# EAGLE design sch1 (EAGLE 7.2.0)
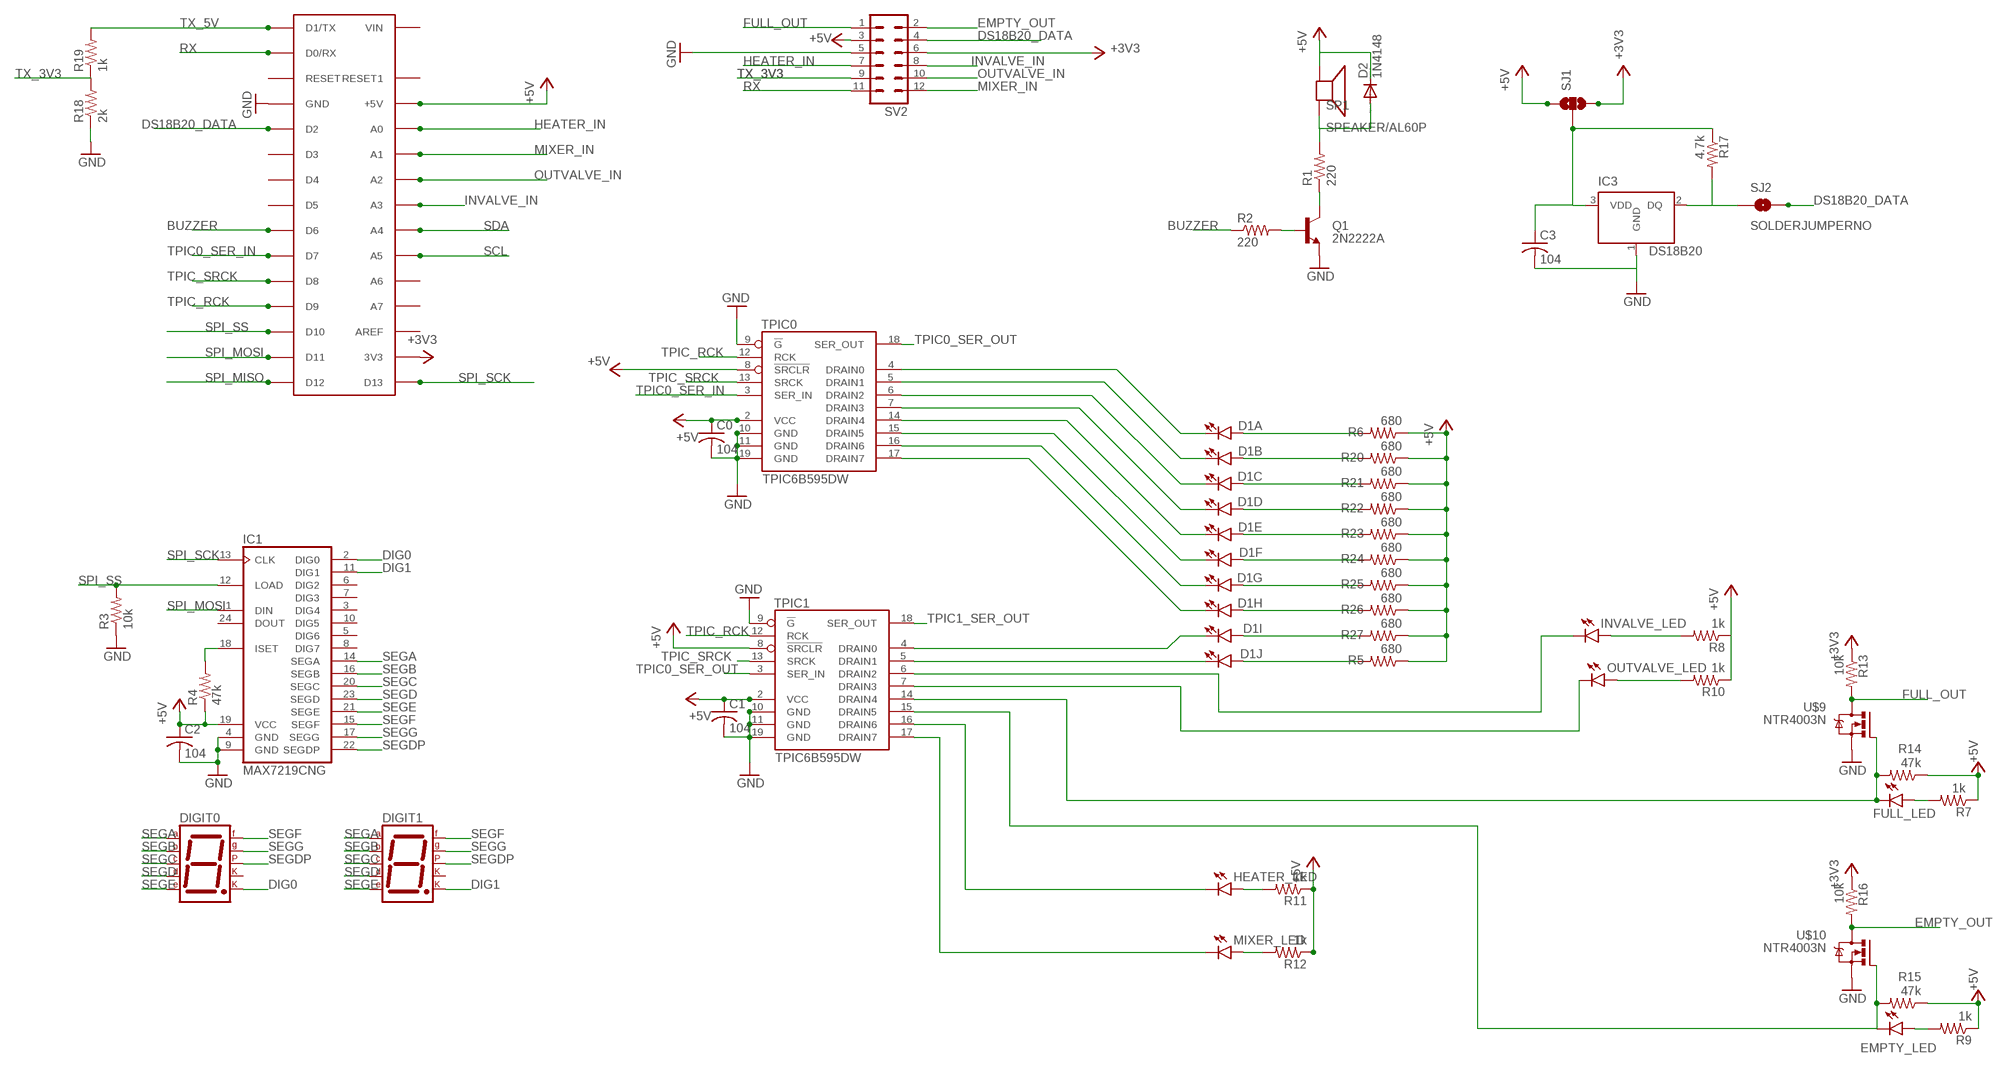
[diagram p0: schematic, sheet 1]

## Parts
ARDUINO  ARDUINONANO  [PDIP-32]
C0  104  C-USC0603  [C0603]
C1  104  C-USC0603  [C0603]
C2  104  C-USC0603  [C0603]
C3  104  C-USC0603  [C0603]
D1  LED_BARGRAPH_10  [LED_BARGAPH_10]
D2  1N4148  1N4148DO35-7  [DO35-7]
DIGIT0  7SEG-CK  [7SEG-13]
DIGIT1  7SEG-CK  [7SEG-13]
EMPTY_LED  LED0603  [LED-0603]
FULL_LED  LED0603  [LED-0603]
HEATER_LED  LED0603  [LED-0603]
IC1  MAX7219CNG  [DIL24-3]
IC3  DS18B20  [TO-92]
INVALVE_LED  LED0603  [LED-0603]
MIXER_LED  LED0603  [LED-0603]
OUTVALVE_LED  LED0603  [LED-0603]
Q1  2N2222A  TRANSISTOR_NPNMMBT2222A  [SOT23-3]
R1  220  R-US_R0603  [R0603]
R2  220  R-US_R0603  [R0603]
R3  10k  R-US_R0603  [R0603]
R4  47k  R-US_R0603  [R0603]
R5  680  R-US_R0603  [R0603]
R6  680  R-US_R0603  [R0603]
R7  1k  R-US_R0603  [R0603]
R8  1k  R-US_R0603  [R0603]
R9  1k  R-US_R0603  [R0603]
R10  1k  R-US_R0603  [R0603]
R11  1k  R-US_R0603  [R0603]
R12  1k  R-US_R0603  [R0603]
R13  10k  R-US_R0603  [R0603]
R14  47k  R-US_R0603  [R0603]
R15  47k  R-US_R0603  [R0603]
R16  10k  R-US_R0603  [R0603]
R17  4.7k  R-US_R0603  [R0603]
R18  2k  R-US_R0603  [R0603]
R19  1k  R-US_R0603  [R0603]
R20  680  R-US_R0603  [R0603]
R21  680  R-US_R0603  [R0603]
R22  680  R-US_R0603  [R0603]
R23  680  R-US_R0603  [R0603]
R24  680  R-US_R0603  [R0603]
R25  680  R-US_R0603  [R0603]
R26  680  R-US_R0603  [R0603]
R27  680  R-US_R0603  [R0603]
SJ1  SOLDERJUMPER_2WAYS  [SJ_3]
SJ2  SOLDERJUMPERNO  [SJ_2S-NO]
SP1  SPEAKER/AL60P  [AL60P]
SV2  MA06-2  [MA06-2]
TPIC0  TPIC6B595DW  [SO20W]
TPIC1  TPIC6B595DW  [SO20W]
U$9  NTR4003N  [SOT23]
U$10  NTR4003N  [SOT23]

## Nets
+3V3: ARDUINO.17(3V3) R13.1 R16.1 SJ1.3 SV2.6
+5V: ARDUINO.27(+5V) C0.1 C1.1 C2.1 D2.C IC1.19(VCC) R4.1 R5.1 R6.1 R7.1 R8.1 R9.1 R10.1 R11.1 R12.1 R14.1 R15.1 R20.1 R21.1 R22.1 R23.1 R24.1 R25.1 R26.1 R27.1 SJ1.1 SP1.1(+) SV2.3 TPIC0.2(VCC) TPIC0.8(!SRCLR) TPIC1.2(VCC) TPIC1.8(!SRCLR)
BUZZER: ARDUINO.9(D6) R2.1
DIG0: DIGIT0.8(CK2) IC1.2(DIG0)
DIG1: DIGIT1.8(CK2) IC1.11(DIG1)
DS18B20_DATA: ARDUINO.5(D2) SJ2.2 SV2.4
EMPTY_OUT: R16.2 SV2.2 U$10.3(D)
FULL_OUT: R13.2 SV2.1 U$9.3(D)
GND: ARDUINO.4(GND) ARDUINO.29(GND) C0.2 C1.2 C2.2 C3.2 IC1.4(GND) IC1.9(GND) IC3.1(GND) Q1.2(E) R3.1 R18.1 SV2.5 TPIC0.9(!G) TPIC0.10(GND) TPIC0.11(GND) TPIC0.19(GND) TPIC1.9(!G) TPIC1.10(GND) TPIC1.11(GND) TPIC1.19(GND) U$9.2(S) U$10.2(S)
HEATER_IN: ARDUINO.19(A0) SV2.7
INVALVE_IN: ARDUINO.22(A3) SV2.8
MIXER_IN: ARDUINO.20(A1) SV2.12
N$1: D1.2(B:A) R20.2
N$2: D1.1(A:A) R6.2
N$3: FULL_LED.A R7.2
N$4: INVALVE_LED.A R8.2
N$5: D1.16(E:C) TPIC0.14(DRAIN4)
N$6: D1.15(F:C) TPIC0.15(DRAIN5)
N$7: D1.3(C:A) R21.2
N$8: D1.13(H:C) TPIC0.17(DRAIN7)
N$9: D1.12(I:C) TPIC1.4(DRAIN0)
N$10: D1.11(J:C) TPIC1.5(DRAIN1)
N$11: EMPTY_LED.C R15.2 TPIC1.15(DRAIN5) U$10.1(G)
N$12: OUTVALVE_LED.C TPIC1.7(DRAIN3)
N$13: HEATER_LED.C TPIC1.16(DRAIN6)
N$14: MIXER_LED.C TPIC1.17(DRAIN7)
N$15: INVALVE_LED.C TPIC1.6(DRAIN2)
N$16: D2.A R1.2 SP1.2(-)
N$17: FULL_LED.C R14.2 TPIC1.14(DRAIN4) U$9.1(G)
N$18: Q1.3(C) R1.1
N$19: Q1.1(B) R2.2
N$20: IC1.18(ISET) R4.2
N$21: D1.14(G:C) TPIC0.16(DRAIN6)
N$22: D1.20(A:C) TPIC0.4(DRAIN0)
N$23: D1.19(B:C) TPIC0.5(DRAIN1)
N$24: D1.18(C:C) TPIC0.6(DRAIN2)
N$25: D1.17(D:C) TPIC0.7(DRAIN3)
N$26: D1.4(D:A) R22.2
N$27: D1.5(E:A) R23.2
N$28: D1.6(F:A) R24.2
N$29: D1.7(G:A) R25.2
N$30: D1.8(H:A) R26.2
N$31: D1.9(I:A) R27.2
N$32: D1.10(J:A) R5.2
N$33: C3.1 IC3.3(VDD) R17.1 SJ1.2
N$34: IC3.2(DQ) R17.2 SJ2.1
N$36: EMPTY_LED.A R9.2
N$37: OUTVALVE_LED.A R10.2
N$38: HEATER_LED.A R11.2
N$39: MIXER_LED.A R12.2
OUTVALVE_IN: ARDUINO.21(A2) SV2.10
RX: ARDUINO.2(D0/RX) SV2.11
SCL: ARDUINO.24(A5)
SDA: ARDUINO.23(A4)
SEGA: DIGIT0.7(A) DIGIT1.7(A) IC1.14(SEGA)
SEGB: DIGIT0.6(B) DIGIT1.6(B) IC1.16(SEGB)
SEGC: DIGIT0.4(C) DIGIT1.4(C) IC1.20(SEGC)
SEGD: DIGIT0.2(D) DIGIT1.2(D) IC1.23(SEGD)
SEGDP: DIGIT0.5(DP) DIGIT1.5(DP) IC1.22(SEGDP)
SEGE: DIGIT0.1(E) DIGIT1.1(E) IC1.21(SEGE)
SEGF: DIGIT0.9(F) DIGIT1.9(F) IC1.15(SEGF)
SEGG: DIGIT0.10(G) DIGIT1.10(G) IC1.17(SEGG)
SPI_MISO: ARDUINO.15(D12)
SPI_MOSI: ARDUINO.14(D11) IC1.1(DIN)
SPI_SCK: ARDUINO.16(D13) IC1.13(CLK)
SPI_SS: ARDUINO.13(D10) IC1.12(LOAD) R3.2
TPIC0_SER_IN: ARDUINO.10(D7) TPIC0.3(SER_IN)
TPIC0_SER_OUT: TPIC0.18(SER_OUT) TPIC1.3(SER_IN)
TPIC1_SER_OUT: TPIC1.18(SER_OUT)
TPIC_RCK: ARDUINO.12(D9) TPIC0.12(RCK) TPIC1.12(RCK)
TPIC_SRCK: ARDUINO.11(D8) TPIC0.13(SRCK) TPIC1.13(SRCK)
TX_3V3: R18.2 R19.1 SV2.9
TX_5V: ARDUINO.1(D1/TX) R19.2
Unconnected: ARDUINO.3(RESET) ARDUINO.6(D3) ARDUINO.7(D4) ARDUINO.8(D5) ARDUINO.18(AREF) ARDUINO.25(A6) ARDUINO.26(A7) ARDUINO.28(RESET1) ARDUINO.30(VIN) DIGIT0.3(CK1) DIGIT1.3(CK1) IC1.3(DIG4) IC1.5(DIG6) IC1.6(DIG2) IC1.7(DIG3) IC1.8(DIG7) IC1.10(DIG5) IC1.24(DOUT)

## Library data of the parts
ARDUINO = jet-lib:ARDUINONANO
C0 C1-C3 = rcl:C-US: CAPACITOR, American symbol
D1 = SparkFun-LED:LED_BARGRAPH_10: 10-Segment LED Bar Graph SFE part numbers: COM-09935 (red, Vf = 2.1V, Ifmax = 20mA) COM-09936 (yellow, Vf = 2.1V, Ifmax = 20mA) COM-09937 (blue, Vf = 3.4V, Ifmax = 20mA) COM-09938 (green, Vf = 3.4V, Ifmax = 20mA)
D2 = diode:1N4148: DIODE high speed (Philips)
DIGIT0 DIGIT1 = special:7SEG-CK: 7-segment DISPLAY single cathode, 13 mm
EMPTY_LED FULL_LED HEATER_LED INVALVE_LED MIXER_LED OUTVALVE_LED = SparkFun-LED:LED: LEDs Standard schematic elements and footprints for 5mm, 3mm, 1206, and 0603 sized LEDs. 5mm - Spark Fun Electronics SKU : COM-00529 (and others)
IC1 = maxim:MAX7219CNG: LED DISPLAY DRIVER; MF: MAXIM; MPN: MAX7219CNG; OC_FARNELL: 1523914; OC_NEWARK: 34C4018
IC3 = DS18B20:DS18B20: DS18B20 - 1-Wire Digital Thermometer
Q1 = SparkFun-DiscreteSemi:TRANSISTOR_NPN: Generic NPN BJT MMBT2222A - TRANS-08049 (SOT-23, 1A 40V) MPSA42 - TRANS-09116 (SOT-23, 500mA 300V) MMBT5088LT1G - TRANS-11160 (SOT-23, 50 mA 30V) BC547 - COM-08928 <http://www.sparkfun.com/products/8928> (TO-92 45V 100mA) (1.Collector 2.Base 3.Emitter) 2N3904 - COM-00521 <http://www.sparkfun.com/products/521> (TO-92 40V 200mA) (1.Emitter 2.Base 3.Collector) P2N2222A - COM-12852 <http://www.sparkfun.com/products/12852> (TO-92 40V 600mA) (1.Collector 2.Base 3.Emitter); PROD_ID: TRANS-08049; VALUE: MMBT2222A
R1-R27 = adafruit:R-US_: RESISTOR, American symbol
SJ1 = SparkFun-Retired:SOLDERJUMPER_2WAY: Solder Jumper 2 way solder jumper
SJ2 = SparkFun-Retired:SOLDERJUMPER: Solder Jumper Standard SMD solder jumper. Used to automate production. Two varients : Normally Open and Normally Closed are the same, but have different paste layers. NC will have a large amount of paste and should jumper during reflow.
SP1 = adafruit:SPEAKER: SPEAKER Source: Buerklin Added PS12 (for part # PS1240 piezo) http://www.ladyada.net/library/pcb/eaglelibrary.html
SV2 = con-lstb:MA06-2: PIN HEADER; OC_FARNELL: unknown; OC_NEWARK: unknown
TPIC0 TPIC1 = TPIC6B595:TPIC6B595
U$9 U$10 = NTR4003N:NTR4003N

## Board
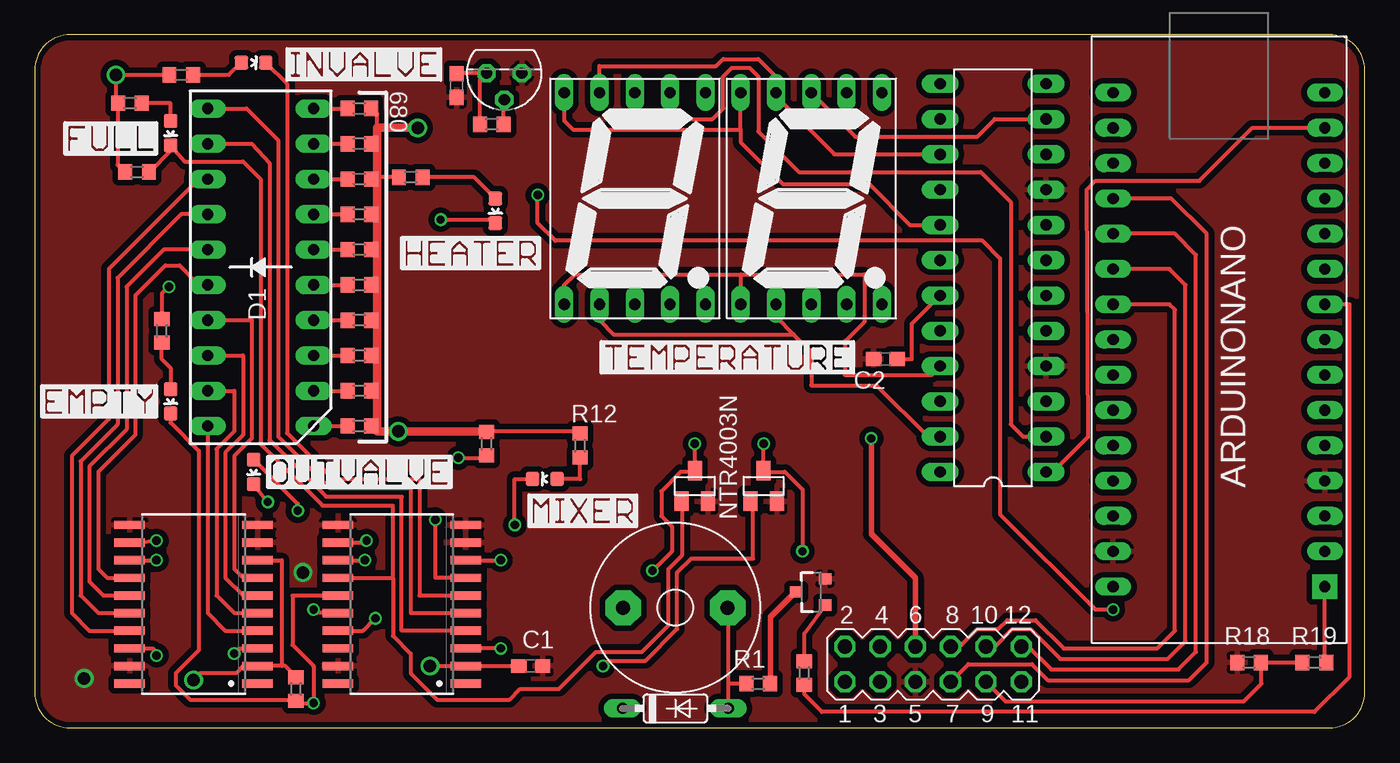
[diagram p1: board, top side]
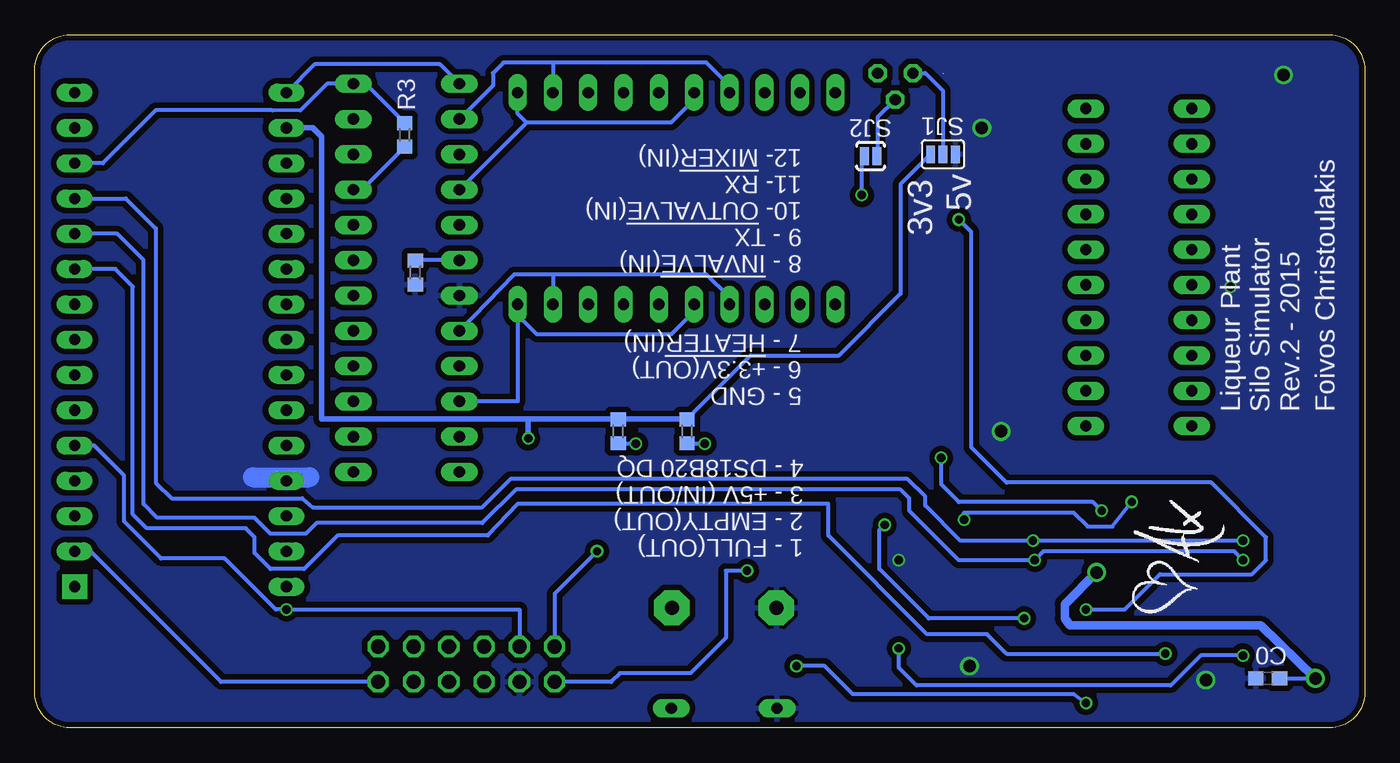
[diagram p2: board, bottom side, seen from below]

Size 95.71 x 49.89 mm. Coordinates in mm from the lower left corner, seen from the top.
Outline: 95.71,2.54 95.71,47.35 arc90 93.17,49.89 2.54,49.89 arc90 0,47.35 0,2.54 arc90 2.54,0 93.17,0 arc90 95.71,2.54
Copper layers (1*16): Top 0.035mm / dielectric 1.5mm / Bottom 0.035mm
Design rules "ITEADstudio_DRC": minimum track width 6mil, minimum drill 12mil, track to track 6mil, track to pad 6mil, pad to pad 6mil, via to via 6mil, smd to smd 0mil, copper to edge 10mil, drill to drill 10mil, minimum pad ring 10mil, minimum via ring 6mil, stop-mask expansion 2mil, vias tented up to drill 100mil, thermal gap 10mil

### Footprints (pad centres in the part's own frame; a part is rotated, then mirrored left to right if it is on the bottom)
PDIP-32 = drill 0.8 pad 1.778 square: 1 0,-2.54 | drill 0.8 long: 2 0,-5.08; 3 0,-7.62; 4 0,-10.16; 5 0,-12.7; 6 0,-15.24; 7 0,-17.78; 8 0,-20.32; 9 0,-22.86; 10 0,-25.4; 11 0,-27.94; 12 0,-30.48; 13 0,-33.02; 14 0,-35.56; 15 0,-38.1; 16 15.24,-38.1; 17 15.24,-35.56; 18 15.24,-33.02; 19 15.24,-30.48; 20 15.24,-27.94; 21 15.24,-25.4; 22 15.24,-22.86; 23 15.24,-20.32; 24 15.24,-17.78; 25 15.24,-15.24; 26 15.24,-12.7; 27 15.24,-10.16; 28 15.24,-7.62; 29 15.24,-5.08; 30 15.24,-2.54
C0603 = smd 1.1 x 1: 1 -0.85,0; 2 0.85,0
LED_BARGAPH_10 = drill 0.813 long: 1 -11.43,-3.81; 2 -8.89,-3.81; 3 -6.35,-3.81; 4 -3.81,-3.81; 5 -1.27,-3.81; 6 1.27,-3.81; 7 3.81,-3.81; 8 6.35,-3.81; 9 8.89,-3.81; 10 11.43,-3.81; 11 11.43,3.81; 12 8.89,3.81; 13 6.35,3.81; 14 3.81,3.81; 15 1.27,3.81; 16 -1.27,3.81; 17 -3.81,3.81; 18 -6.35,3.81; 19 -8.89,3.81; 20 -11.43,3.81
DO35-7 = drill 0.813 long: A 3.81,0; C -3.81,0
7SEG-13 = drill 0.813 long: 1 -5.08,-7.62; 2 -2.54,-7.62; 3 0,-7.62; 4 2.54,-7.62; 5 5.08,-7.62; 6 5.08,7.62; 7 2.54,7.62; 8 0,7.62; 9 -2.54,7.62; 10 -5.08,7.62
LED-0603 = smd 1 x 1: A 0,-0.877; C 0,0.877
DIL24-3 = drill 0.813 long: 1 -13.97,-3.81; 2 -11.43,-3.81; 3 -8.89,-3.81; 4 -6.35,-3.81; 5 -3.81,-3.81; 6 -1.27,-3.81; 7 1.27,-3.81; 8 3.81,-3.81; 9 6.35,-3.81; 10 8.89,-3.81; 11 11.43,-3.81; 12 13.97,-3.81; 13 13.97,3.81; 14 11.43,3.81; 15 8.89,3.81; 16 6.35,3.81; 17 3.81,3.81; 18 1.27,3.81; 19 -1.27,3.81; 20 -3.81,3.81; 21 -6.35,3.81; 22 -8.89,3.81; 23 -11.43,3.81; 24 -13.97,3.81
TO-92 = drill 0.813 pad 1.27 octagon: 1 -1.27,0; 2 0,1.905; 3 1.27,0
SOT23-3 = smd 0.8 x 0.9: 1 -0.95,-1; 2 0.95,-1; 3 0,1.1
R0603 = smd 1 x 1.1: 1 -0.85,0; 2 0.85,0
SJ_3 = smd 0.635 x 1.27: 1 -0.889,0; 2 0,0; 3 0.889,0
SJ_2S-NO = smd 0.635 x 1.27: 1 -0.45,0; 2 0.45,0
AL60P = drill 1.016 pad 2.54 octagon: 1 -3.759,0; 2 3.759,0
MA06-2 = drill 1.016 octagon: 1 -6.35,-1.27; 2 -6.35,1.27; 3 -3.81,-1.27; 4 -3.81,1.27; 5 -1.27,-1.27; 6 -1.27,1.27; 7 1.27,-1.27; 8 1.27,1.27; 9 3.81,-1.27; 10 3.81,1.27; 11 6.35,-1.27; 12 6.35,1.27
SO20W = smd 0.6 x 2.2: 1 -5.715,-4.6; 2 -4.445,-4.6; 3 -3.175,-4.6; 4 -1.905,-4.6; 5 -0.635,-4.6; 6 0.635,-4.6; 7 1.905,-4.6; 8 3.175,-4.6; 9 4.445,-4.6; 10 5.715,-4.6; 11 5.715,4.6; 12 4.445,4.6; 13 3.175,4.6; 14 1.905,4.6; 15 0.635,4.6; 16 -0.635,4.6; 17 -1.905,4.6; 18 -3.175,4.6; 19 -4.445,4.6; 20 -5.715,4.6
SOT23 = smd 1 x 1.4: 1 -0.95,-1.1; 2 0.95,-1.1; 3 0,1.1

### Placement (x,y rotation side)
ARDUINO  92.84,7.62 180 top
C0  6.99,3.56 0 bottom
C1  35.69,4.45 0 top
C2  61.21,26.54 180 top
C3  30.35,46.23 270 top
D1  16.26,33.15 90 top
D2  46.1,1.4 0 top
DIGIT0  43.18,38.1 0 top
DIGIT1  55.88,38.1 0 top
EMPTY_LED  9.78,23.5 180 top
FULL_LED  9.78,42.8 180 top
HEATER_LED  33.15,37.21 180 top
IC1  68.96,32.38 90 top
IC3  33.78,47.12 180 top
INVALVE_LED  15.75,47.88 270 top
MIXER_LED  36.7,17.91 90 top
OUTVALVE_LED  15.75,18.41 180 top
Q1  55.88,9.78 90 top
R1  52.07,3.17 180 top
R2  55.37,3.94 90 top
R3  69.09,42.67 90 bottom
R4  68.33,32.77 90 bottom
R5  23.37,44.58 180 top
R6  23.37,21.72 180 top
R7  6.86,44.96 0 top
R8  10.54,46.99 0 top
R9  9.14,28.57 270 top
R10  32.51,20.45 270 top
R11  27.05,39.62 0 top
R12  39.24,20.32 270 top
R13  48.77,21.34 270 bottom
R14  7.37,40.01 0 top
R15  18.8,2.79 270 top
R16  53.72,21.34 270 bottom
R17  32.89,43.43 0 top
R18  87.38,4.7 0 top
R19  92.08,4.7 0 top
R20  23.37,24.26 180 top
R21  23.37,26.8 180 top
R22  23.37,29.34 180 top
R23  23.37,31.88 180 top
R24  23.37,34.42 180 top
R25  23.37,36.96 180 top
R26  23.37,39.5 180 top
R27  23.37,42.04 180 top
SJ1  30.35,41.27 180 bottom
SJ2  35.56,41.15 180 bottom
SP1  46.1,8.64 0 top
SV2  64.64,4.57 0 top
TPIC0  11.43,8.89 90 top
TPIC1  26.42,8.89 90 top
U$1  [HALX2_532_SILKSCREEN]  12.06,8.89 90 bottom
U$2  [INVALVE70]  18.03,46.48 0 top
U$3  [FULL70]  2.03,41.15 0 top
U$4  [EMPTY70]  0.38,22.23 0 top
U$5  [OUTVALVE70]  16.64,17.14 0 top
U$6  [TEMPERATURE70]  40.64,25.4 0 top
U$7  [MIXER70]  35.43,14.35 0 top
U$8  [HEATER70]  26.29,32.89 0 top
U$9  47.5,17.4 0 top
U$10  52.45,17.4 0 top

### Tracks (layer width: path | path; a pad name or v marks a point on that pad's centre or on a via)
+3V3  (via drill 0.6)
  Top 0.406: v60.2,20.83 60.2,13.97 63.37,10.79 SV2.6
  Bottom 0.305: R16.1 R13.1 48.77,22.23 44.2,26.8 37.85,26.8 33.4,31.24 33.4,39.12 SJ1.3
  Bottom 0.406: ARDUINO.17 75.69,43.18 75.06,42.55 75.06,22.23 60.2,22.23 | 60.2,22.23 48.77,22.23 | 60.2,22.23 v60.2,20.83
+5V  (via drill 0.6, 0.9)
  Top 0.305: v33.53,12.06 TPIC1.8 30.99,12.06 | 17.78,4.45 TPIC0.2 14.99,4.45 14.48,3.94 11.94,3.94 v11.43,3.43 | v9.65,31.75 9.14,31.24 R9.1 | R8.1 v5.84,46.99 5.84,44.96 5.97,44.96 | 17.78,4.45 17.78,12.06 TPIC0.8 16,12.06 | v28.45,4.45 TPIC1.2 C1.1 | 62.1,26.54 63.12,26.54 63.12,29.08 IC1.19 | 62.1,26.54 62.1,26.8 | R12.1 39.24,21.34 32.64,21.34 | 5.97,44.96 5.97,40.51 6.48,40.01 R14.1 | R10.1 32.51,21.34 | 5.97,44.96 R7.1 | 24.38,21.72 R6.1 24.22,21.34 24.64,21.34 | 62.1,26.54 C2.1 | R27.1 24.64,42.04 | R26.1 24.64,39.5 | R25.1 24.64,36.96 | R24.1 24.64,34.42 | R23.1 24.64,31.88 | R22.1 24.64,29.34 24.64,29.46 | R21.1 24.64,26.8 | R20.1 24.64,24.26 | 24.64,43.18 24.64,44.2 24.26,44.58 R5.1 | 26.16,39.62 24.64,39.62 | 17.78,4.45 18.03,4.45 18.8,3.68 R15.1
  Top 0.61: 32.64,21.34 32.51,21.34 v26.16,21.34 24.64,21.34 24.64,24.26 24.64,26.8 24.64,29.46 24.64,31.88 24.64,34.42 24.64,36.96 24.64,39.5 24.64,39.62 24.64,42.04 24.64,43.18 v27.56,43.18 | 26.16,39.62 R11.1
  Bottom 1.422: 80.01,18.03 75.95,18.03
  pour Bottom (isolate 0.406): 95.71,2.54 95.71,47.35 arc90 93.17,49.89 2.54,49.89 arc90 0,47.35 0,2.54 arc90 2.54,0 93.17,0 arc90
BUZZER
  Top 0.305: R2.1 55.37,2.41 56.64,1.14 92.08,1.14 94.61,3.68 94.61,30.48 ARDUINO.9
DIG0
  Top 0.305: DIGIT0.8 43.18,44.58 43.94,43.81 48.77,43.81 49.53,44.58 49.53,46.86 50.16,47.5 51.44,47.5 52.07,46.86 52.07,42.93 54.99,40.01 68.07,40.01 70.23,37.85 70.23,21.84 71.12,20.95 IC1.2
DIG1
  Top 0.305: DIGIT1.8 59.05,42.55 67.82,42.55 69.09,43.81 IC1.11
DS18B20_DATA  (via drill 0.6)
  Top 0.305: v36.2,38.35 36.2,36.32 37.47,35.05 68.2,35.05 69.47,33.78 69.47,15.37 76.33,8.51 v77.6,8.51
  Bottom 0.305: ARDUINO.5 91.44,20.32 89.28,18.16 89.28,14.86 86.61,12.19 82.04,12.19 78.36,8.51 v77.6,8.51 60.83,8.51 SV2.4 | v36.2,38.35 36.2,41.15 SJ2.2
EMPTY_OUT  (via drill 0.6)
  Top 0.305: v52.45,20.45 U$10.3 52.45,18.41 53.98,18.41 55.24,17.14 v55.24,12.7
  Bottom 0.305: v52.45,20.45 53.72,20.45 R16.2 | v55.24,12.7 58.29,9.65 SV2.2
FULL_OUT  (via drill 0.6)
  Top 0.305: v47.5,20.45 U$9.3 47.5,18.41 46.48,18.41 45.09,17.02 45.09,15.24 45.85,14.48 45.85,12.7 v44.45,11.3
  Bottom 0.305: v47.5,20.45 48.77,20.45 R13.2 | v44.45,11.3 45.97,11.3 45.97,6.48 48.51,3.94 53.59,3.94 54.23,3.3 SV2.1
GND  (via drill 0.9)
  Bottom 0.305: C0.2 v3.56,3.56 | IC1.9 72.14,38.73 69.09,41.78 R3.1
  Bottom 0.61: v19.3,11.18 21.59,8.89 21.59,7.87 21.21,7.37 7.49,7.37 v3.56,3.56
  pour Top (isolate 0.406): 93.17,0 2.54,0 arc-90 0,2.54 0,47.35 arc-90 2.54,49.89 93.17,49.89 arc-90 95.71,47.35 95.71,2.54 arc-90
HEATER_IN
  Top 0.305: SV2.7 67.18,4.57 71.75,4.57 72.9,3.43 83.06,3.43 84.33,4.7 84.33,35.56 81.79,38.1 ARDUINO.19
INVALVE_IN
  Top 0.305: SV2.8 66.55,5.84 67.82,7.11 69.34,7.11 69.98,7.75 72.01,7.75 74.04,5.71 80.77,5.71 82.04,6.99 82.04,30.1 81.66,30.48 ARDUINO.22
MIXER_IN
  Top 0.305: SV2.12 71.5,5.84 73.15,4.19 82.3,4.19 83.57,5.46 83.57,34.04 82.04,35.56 ARDUINO.20
N$1
  Top 0.305: D1.2 R20.2
N$2
  Top 0.305: D1.1 R6.2
N$3
  Top 0.305: FULL_LED.A 9.78,44.96 R7.2
N$4
  Top 0.305: INVALVE_LED.A 13.97,47.01 13.72,46.99 R8.2
N$5
  Top 0.305: 6.86,10.79 TPIC0.14 5.21,10.79 4.57,11.43 4.57,18.41 7.24,21.08 7.24,31.11 9.4,33.27 10.41,33.27 11.81,31.88 D1.16
N$6
  Top 0.305: D1.15 9.27,34.42 6.6,31.75 6.6,21.46 3.94,18.8 3.94,10.53 4.94,9.53 TPIC0.15 6.99,9.53
N$7
  Top 0.305: D1.3 R21.2
N$8
  Top 0.305: D1.13 11.81,39.5 5.33,33.02 5.33,22.23 2.67,19.56 2.67,8.26 3.94,6.99 TPIC0.17 6.99,6.99
N$9
  Top 0.305: D1.12 15.62,42.04 16.89,40.64 16.89,20.7 20.95,16.64 26.42,16.64 26.42,6.99 TPIC1.4
N$10
  Top 0.305: D1.11 15.24,44.58 17.53,42.29 17.53,20.95 21.21,17.27 27.05,17.27 27.05,8.26 TPIC1.5
N$11  (via drill 0.6)
  Top 0.305: EMPTY_LED.C 9.78,21.97 11.81,19.94 11.81,5.59 10.16,3.94 10.16,3.05 11.18,2.03 18.8,2.03 R15.2 18.8,1.78 v20.07,1.78 20.07,4.45 18.54,5.97 18.54,9.53 TPIC1.15 21.84,9.53 | v40.89,4.45 41.27,4.83 43.94,4.83 46.23,7.11 46.23,11.18 47.24,12.19 51.69,12.19 51.69,16 51.44,16.26 51.44,16.3 U$10.1
  Bottom 0.305: v20.07,1.78 20.95,2.41 36.83,2.41 38.86,4.45 v40.89,4.45
N$12  (via drill 0.6)
  Top 0.305: TPIC1.7 28.83,10.79 v28.83,14.99 | v16.76,16.26 15.75,17.53 OUTVALVE_LED.C
  Bottom 0.305: v28.83,14.99 28.83,15.49 20.95,15.49 19.94,14.48 18.16,14.48 v16.76,16.26
N$13  (via drill 0.6)
  Top 0.305: v20.07,8.51 20.32,8.26 TPIC1.16 21.84,8.26 | v29.21,36.58 32.89,36.58 HEATER_LED.C
  Bottom 0.305: v20.07,8.51 17.27,8.51 14.73,11.05 8.13,11.05 7.11,12.06 7.11,13.72 11.05,17.65 25.78,17.65 28.32,20.19 28.32,35.69 v29.21,36.58
N$14  (via drill 0.6)
  Top 0.305: TPIC1.17 23.62,6.99 v24.51,7.87 | v34.54,14.61 34.54,17.91 MIXER_LED.C
  Bottom 0.305: v24.51,7.87 31.37,7.87 34.92,11.43 34.92,14.22 v34.54,14.61
N$15
  Top 0.305: 16.7,47.82 18.16,46.35 18.16,21.21 21.46,17.91 27.69,17.91 27.69,9.53 TPIC1.6 | 16.7,47.82 16.64,47.88 | INVALVE_LED.C 16.7,47.88 16.7,47.82
N$16
  Top 0.305: D2.A 49.91,3.17 | 49.91,3.17 49.91,8.64 SP1.2 | R1.2 49.91,3.17
N$17
  Top 0.305: FULL_LED.C 10.79,40.77 14.99,40.77 16.26,39.5 16.26,20.45 20.7,16 25.78,16 25.78,10.79 | TPIC1.14 25.78,10.79 | 25.78,10.79 25.78,6.6 27.05,5.33 27.05,3.94 28.96,2.03 34.16,2.03 34.92,2.79 37.72,2.79 40.39,5.46 43.69,5.46 45.59,7.37 45.59,11.43 46.61,12.45 46.61,16.26 46.55,16.26 U$9.1 | FULL_LED.C 9.78,41.53 8.26,40.01 R14.2 | FULL_LED.C
N$18
  Top 0.406: Q1.3 54.74,9.78 52.96,8 52.96,3.17 R1.1
N$19
  Top 0.305: R2.2 55.37,6.8 Q1.1
N$20
  Bottom 0.305: IC1.18 68.33,33.66 R4.2
N$21
  Top 0.305: D1.14 10.54,36.96 5.97,32.38 5.97,21.84 3.3,19.18 3.3,9.53 4.57,8.26 TPIC0.16 6.99,8.26
N$22
  Top 0.305: D1.20 12.45,8.26 13.72,6.99 TPIC0.4
N$23
  Top 0.305: D1.19 14.35,24.26 14.35,21.34 13.08,20.07 13.08,9.53 14.35,8.26 TPIC0.5
N$24
  Top 0.305: D1.18 14.99,26.8 14.99,21.08 13.72,19.81 13.72,10.79 14.99,9.53 TPIC0.6
N$25
  Top 0.305: D1.17 15.62,29.34 15.62,20.83 14.35,19.56 14.35,11.43 14.99,10.79 TPIC0.7
N$26
  Top 0.305: D1.4 R22.2
N$27
  Top 0.305: D1.5 R23.2
N$28
  Top 0.305: D1.6 R24.2
N$29
  Top 0.305: D1.7 R25.2
N$30
  Top 0.305: D1.8 R26.2
N$31
  Top 0.305: D1.9 R27.2
N$32
  Top 0.305: D1.10 R5.2
N$33  (1 unrouted)
  Top 0.305: 30.35,47.12 IC3.3 32.04,46.65 R17.1
  Bottom 0.305: IC3.3 31.62,47.12 30.35,45.85 SJ1.2
N$34
  Top 0.305: R17.2 33.74,45.17 IC3.2
  Bottom 0.305: IC3.2 35.05,43.94 35.05,41.15 SJ2.1
N$36
  Top 0.305: R9.2 9.14,26.54 9.78,25.91 EMPTY_LED.A
N$37  (via drill 0.6)
  Top 0.305: v18.92,15.62 18.92,16.13 15.75,19.3 OUTVALVE_LED.A | v30.48,19.43 32.51,19.43 R10.2
  Bottom 0.305: v18.92,15.62 19.56,16.26 29.21,16.26 30.48,17.53 v30.48,19.43
N$38
  Top 0.305: HEATER_LED.A 31.62,39.62 R11.2
N$39
  Top 0.305: R12.2 39.24,17.91 MIXER_LED.A
OUTVALVE_IN
  Top 0.305: SV2.10 69.09,5.84 70.36,7.11 71.63,7.11 73.79,4.95 81.53,4.95 82.8,6.22 82.8,31.88 81.66,33.02 ARDUINO.21
RX
  Bottom 0.305: SV2.11 82.3,3.3 91.69,12.7 ARDUINO.2
SEGA
  Bottom 0.305: DIGIT0.7 45.72,46.23 47.37,47.88 58.42,47.88 | 58.42,47.88 DIGIT1.7 | 58.42,47.88 61.98,47.88 62.74,47.12 62.74,46.23 IC1.14
SEGB
  Bottom 0.305: DIGIT0.6 48.26,45.21 49.91,43.56 60.33,43.56 | 60.33,43.56 60.96,44.2 DIGIT1.6 | 60.33,43.56 IC1.16
SEGC
  Bottom 0.305: DIGIT0.4 45.72,30.99 47.37,32.64 58.42,32.64 | 58.42,32.64 61.21,32.64 IC1.20 | 58.42,32.64 DIGIT1.4
SEGD
  Top 0.305: DIGIT0.2 40.64,29.34 41.66,28.32 54.61,28.32 | DIGIT1.2 53.34,29.59 54.61,28.32 | 54.61,28.32 55.88,27.05 55.88,24.64 60.58,24.64 64.26,20.95 IC1.23
SEGDP
  Bottom 0.305: DIGIT0.5 48.26,29.97 49.91,28.32 59.56,28.32 60.96,29.72 | 60.96,29.72 DIGIT1.5 | 60.96,29.72 60.96,23.5 IC1.22
SEGE
  Top 0.305: DIGIT0.1 38.1,31.88 38.86,32.64 50.8,32.64 | 50.8,32.64 DIGIT1.1 | 50.8,32.64 59.69,32.64 59.69,29.21 58.29,27.81 58.29,25.4 64.52,25.4 IC1.21
SEGF
  Top 0.305: DIGIT0.9 40.64,47.62 49.02,47.62 49.53,48.13 52.07,48.13 53.34,46.86 DIGIT1.9 53.34,45.47 57.53,41.27 IC1.15
SEGG
  Top 0.305: DIGIT0.10 38.1,43.69 38.73,43.05 50.8,43.05 | 50.8,43.05 DIGIT1.10 | 50.8,43.05 50.8,42.16 53.85,39.12 60.07,39.12 62.99,36.2 IC1.17
SPI_MOSI
  Top 0.305: IC1.1 73.26,18.41 75.8,20.97 75.7,38.73 76.33,39.37 83.82,39.37 87.63,43.18 ARDUINO.14
SPI_SCK
  Bottom 0.305: IC1.13 66.55,47.75 75.56,47.75 ARDUINO.16
SPI_SS
  Bottom 0.254: 76.58,44.45 78.61,44.45
  Bottom 0.305: 69.15,43.62 71.88,46.35 IC1.12 74.68,46.35 76.58,44.45 | 69.15,43.62 69.09,43.56 | 78.61,44.45 87,44.45 90.81,40.64 ARDUINO.13 | R3.2 69.15,43.52 69.15,43.62
TPIC0_SER_IN  (via drill 0.6)
  Top 0.305: v14.35,5.33 14.73,5.71 16,5.71
  Top 0.406: TPIC0.3 16,5.71
  Bottom 0.305: ARDUINO.10 89.92,33.02 88.65,31.75 88.65,15.35 87.65,14.35 80.52,14.35 79.88,13.72 79.88,12.57 78.74,11.43 76.33,11.43 73.91,13.84 63.12,13.84 60.96,16.13 38.61,16.13 38.61,13.84 31.5,6.73 27.18,6.73 25.78,5.33 v14.35,5.33
TPIC0_SER_OUT  (via drill 0.6)
  Top 0.305: TPIC0.18 8.51,5.71 v8.76,5.21 | v33.53,5.71 TPIC1.3 30.86,5.71
  Bottom 0.305: v8.76,5.21 11.81,5.21 13.97,3.05 32.26,3.05 33.53,4.32 v33.53,5.71
TPIC_RCK  (via drill 0.6)
  Top 0.305: v8.76,13.46 6.86,13.34 TPIC0.12 | TPIC1.12 23.88,13.34 v23.88,13.46
  Bottom 0.305: v8.76,13.46 v23.88,13.46 29.08,13.46 31.62,16 31.62,16.64 32.89,17.91 61.47,17.91 63.5,15.88 75.69,15.88 76.45,16.51 85.87,16.51 87,17.64 87,35.94 89.15,38.1 ARDUINO.12
TPIC_SRCK  (via drill 0.6)
  Top 0.305: TPIC0.13 v8.76,12.06 | TPIC1.13 v23.75,12.06
  Bottom 0.305: v8.76,12.06 9.4,12.7 23.11,12.7 v23.75,12.06 29.21,12.06 32.77,15.62 32.77,16.51 33.4,17.14 61.09,17.14 63.5,14.73 75.44,14.73 76.2,13.97 78.74,13.97 79.88,15.11 86.88,15.11 87.88,16.11 87.88,33.66 89.79,35.56 ARDUINO.11
TX_3V3
  Top 0.305: SV2.9 69.85,1.91 87,1.91 88.27,3.17 88.27,4.7 | 88.27,4.7 R19.1 | 88.27,4.7 R18.2
TX_5V
  Top 0.305: R19.2 92.84,4.7 ARDUINO.1

### Text on the board
tPlace: 680 | NTR4003N | 2 | 4 | 6 | 8 | 10 | 3 | 5 | 7 | 9 | 11
bPlace: 8 - !INVALVE!(IN) / 9 - TX / 10- !OUTVALVE!(IN) / 11- RX / 12- !MIXER!(IN) | 5v | 3v3 | 5 - GND / 6 - +3.3V(OUT) / 7 - !HEATER!(IN) | Foivos Christoulakis | Liqueur Plant / Silo Simulator / Rev.2 - 2015 | 1 - FULL(OUT) / 2 - EMPTY(OUT) / 3 - +5V (IN/OUT) / 4 - DS18B20 DQ